# Altium schematic sheet POWR0004.SchDoc: BLUEsat Power Switch Structure
size A3; Author: Ekramul Nafis Islam; CompanyName: BLUEsat Project; Engineer: Ekramul Nafis Islam; Organization: BLUEsat; Address1: Room 419; Address2: School of EET; Address3: UNSW; Address4: 2052; DocumentNumber: POWR0004; SheetNumber: 1; SheetTotal: 1; Description: Structure for Multiple LDO devices from common bus; Version: 1.0
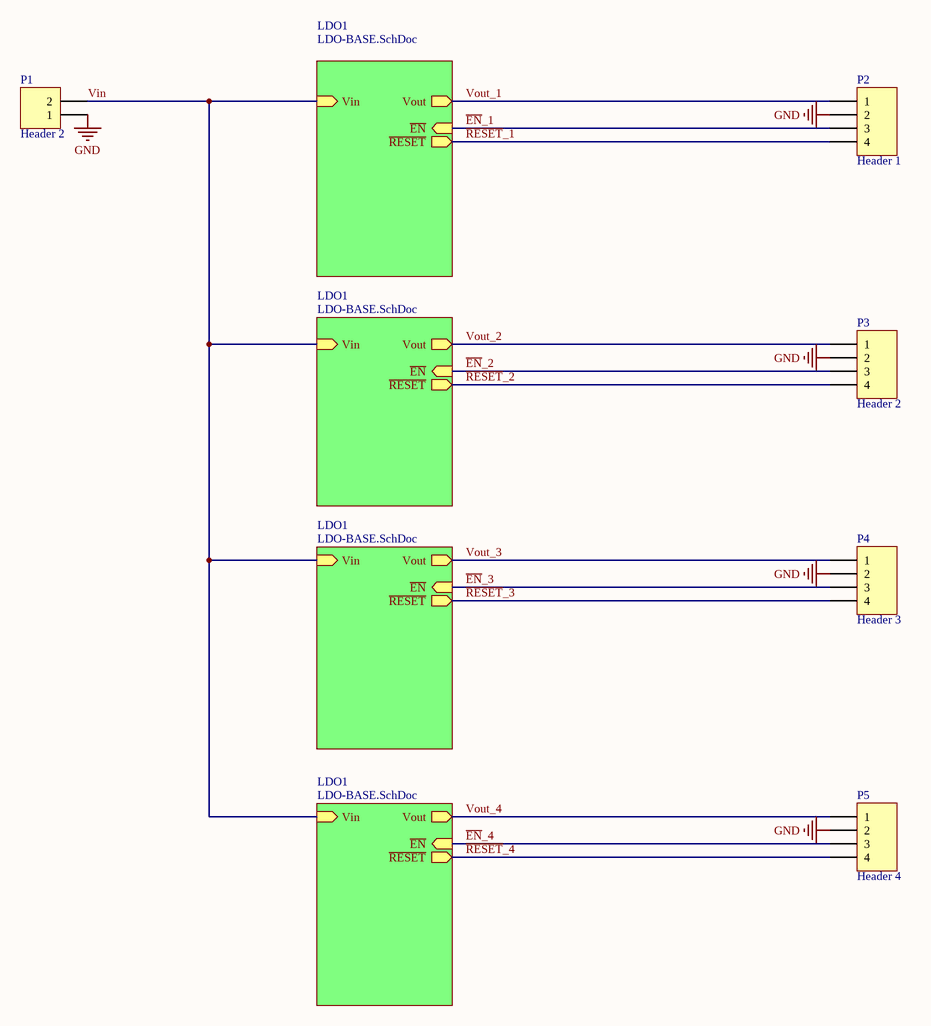
[diagram p0: POWR0004.SchDoc]

## Parts
P1  Header 2  [HDR1X2]
P2  Header 1  [HDR1X4]
P3  Header 2  [HDR1X4]
P4  Header 3  [HDR1X4]
P5  Header 4  [HDR1X4]

## Sub-sheets
LDO1 = LDO-BASE.SchDoc: Vout (out), ~{EN} (in), ~{RESET} (out), Vin (in)
LDO1 = LDO-BASE.SchDoc: Vout (out), ~{EN} (in), ~{RESET} (out), Vin (in)
LDO1 = LDO-BASE.SchDoc: Vout (out), ~{EN} (in), ~{RESET} (out), Vin (in)
LDO1 = LDO-BASE.SchDoc: Vout (out), ~{EN} (in), ~{RESET} (out), Vin (in)

## Nets
GND: P1.1 P2.2 P3.2 P4.2 P5.2
~{EN}_1: P2.3 ; sheet LDO1/~{EN}
~{EN}_2: P3.3 ; sheet LDO1/~{EN}
~{EN}_3: P4.3 ; sheet LDO1/~{EN}
~{EN}_4: P5.3 ; sheet LDO1/~{EN}
~{RESET}_1: P2.4 ; sheet LDO1/~{RESET}
~{RESET}_2: P3.4 ; sheet LDO1/~{RESET}
~{RESET}_3: P4.4 ; sheet LDO1/~{RESET}
~{RESET}_4: P5.4 ; sheet LDO1/~{RESET}
Vin: P1.2 ; sheet LDO1/Vin, sheet LDO1/Vin, sheet LDO1/Vin, sheet LDO1/Vin
Vout_1: P2.1 ; sheet LDO1/Vout
Vout_2: P3.1 ; sheet LDO1/Vout
Vout_3: P4.1 ; sheet LDO1/Vout
Vout_4: P5.1 ; sheet LDO1/Vout

## Notes on the sheet
- Title
- Description:
- Size:
- Author:
- Date:
- A3
- Time:
- Version
- Sheet:
- Drawing No.:
- of
- File:

## Library data of the parts
P1 = Header 2: Header, 2-Pin; LatestRevisionDate: 17-Jul-2002; LatestRevisionNote: Re-released for DXP Platform.; Publisher: Altium Limited
P2-P5 = Header 4: Header, 4-Pin; LatestRevisionDate: 17-Jul-2002; LatestRevisionNote: Re-released for DXP Platform.; Publisher: Altium Limited